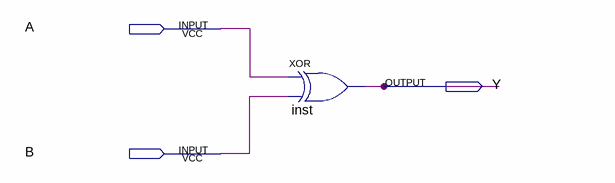
[diagram p0: schematic sheet]
// Quartus schematic Experiment.bdf as structural Verilog: 1 symbols, 3 pins
module Experiment (
  input  A,
  input  B,
  output Y
);

  xor inst (Y, A, B);
endmodule
